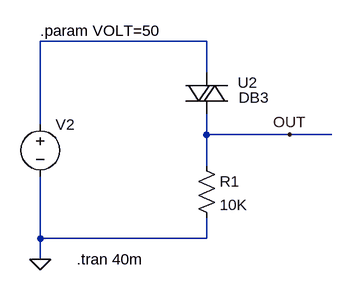
[diagram p0: schematic DB3_Alexander.asc]
DB3_Alexander.asc, the LTspice schematic file:
Version 4.1
SHEET 1 880 680
WIRE -432 0 -688 0
WIRE -432 48 -432 0
WIRE -688 128 -688 0
WIRE -432 144 -432 112
WIRE -304 144 -432 144
WIRE -240 144 -304 144
WIRE -432 192 -432 144
WIRE -688 304 -688 208
WIRE -432 304 -432 272
WIRE -432 304 -688 304
WIRE -688 336 -688 304
FLAG -688 336 0
FLAG -304 144 OUT
SYMBOL voltage -688 112 R0
WINDOW 123 0 0 Left 0
WINDOW 39 0 0 Left 0
WINDOW 3 41 64 Invisible 2
SYMATTR Value SINE(0 {VOLT} 50)
SYMATTR InstName V2
SYMBOL res -448 176 R0
SYMATTR InstName R1
SYMATTR Value 10K
SYMBOL MyLib\\Thyristor_DIAC\\DB3_Alexander -464 48 R0
SYMATTR InstName U2
TEXT -632 336 Left 2 !.tran 40m
TEXT -688 -16 Left 2 !.param VOLT=50

The netlist it stands for:
* DB3_Alexander.asc
V2 N001 0 SINE(0 {VOLT} 50)
R1 OUT 0 10K
X§U2 N001 OUT DB3  ; pins + -
.tran 40m
.param VOLT=50
.lib MyLib/Thyristor_DIAC/DB3_Alexander.lib
.backanno
.end